# Altium project VIO_Camera_module.PrjPcb
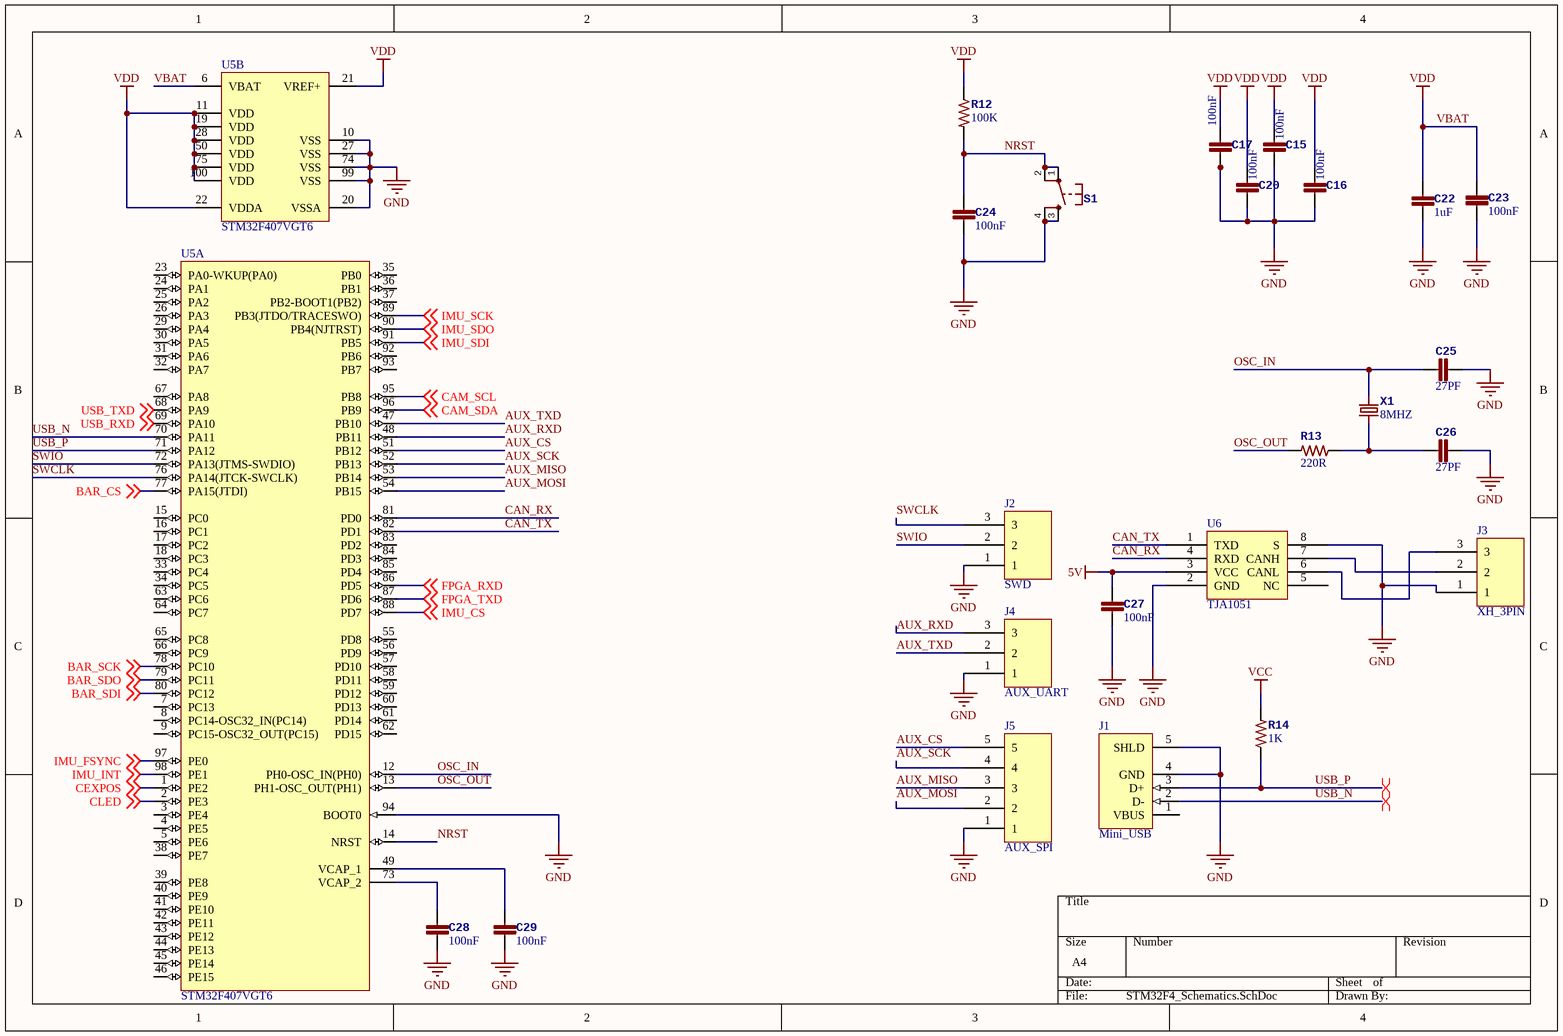
[diagram p0: STM32F4_Schematics.SchDoc]
4 sheets, 58 parts. Net scope: global (net labels, ports and power ports of the same name join across sheets).
Board file: PCB.PcbDoc
Sheets:
  STM32F4_Schematics.SchDoc
  Camera_Schematics.SchDoc
  IMU_Schematics.SchDoc
  USB3_Controller_Schematics.SchDoc

## Sheet STM32F4_Schematics.SchDoc
size A4

### Parts
C15  value 100nF  [_0805]  (hidden comment: Cap)
C16  value 100nF  [_0805]  (hidden comment: Cap)
C17  value 100nF  [_0805]  (hidden comment: Cap)
C20  value 100nF  [_0805]  (hidden comment: Cap)
C22  value 1uF  [_0805]  (hidden comment: Cap)
C23  value 100nF  [_0805]  (hidden comment: Cap)
C24  value 100nF  [_0805]  (hidden comment: Cap)
C25  value 27PF  [_0805]  (hidden comment: Cap)
C26  value 27PF  [_0805]  (hidden comment: Cap)
C27  value 100nF  [_0805]  (hidden comment: Cap)
C28  value 100nF  [_0805]  (hidden comment: Cap)
C29  value 100nF  [_0805]  (hidden comment: Cap)
J1  Mini_USB  [My_USB]
J2  SWD  [XH_3PIN]
J3  XH_3PIN  [XH_3PIN]
J4  AUX_UART  [XH_3PIN]
J5  AUX_SPI  [XH_5PIN]
R12  value 100K  [_0603]  (hidden comment: Resistor)
R13  value 220R  [_0603]  (hidden comment: Resistor)
R14  value 1K  [_0603]  (hidden comment: Resistor)
S1  PushButton-4Pin  [_TACTILE_SWITCH_PTH_6.0MM]  (value not drawn)
U5  STM32F407VGT6  [STM-LQFP100_N]  (parts A,B of 2)
U6  TJA1051  [SO-8N]
X1  value 8MHZ  [_CRYSTAL-HC49UP]  (hidden comment: Crystal_1)

### Nets
5V: C27.2 U6.3(VCC)
GND: C15.1 C16.1 C17.1 C20.1 C22.1 C23.1 C24.2 C25.2 C26.2 C27.1 C28.1 C29.1 J1.4(GND) J1.5(SHLD) J2.1 J3.1 J4.1 J5.1 S1.3 S1.4 U5.10(VSS) U5.20(VSSA) U5.27(VSS) U5.74(VSS) U5.94(BOOT0) U5.99(VSS) U6.2(GND) U6.8(S)
VBAT: C15.2 C16.2 C17.2 C20.2 C22.2 C23.2 R12.1 U5.6(VBAT) U5.11(VDD) U5.19(VDD) U5.21(VREF+) U5.22(VDDA) U5.28(VDD) U5.50(VDD) U5.75(VDD) U5.100(VDD)  [also labelled VDD]
VCC: R14.2
AUX_CS: J5.5 U5.51(PB12)
AUX_MISO: J5.3 U5.53(PB14)
AUX_MOSI: J5.2 U5.54(PB15)
AUX_RXD: J4.3 U5.48(PB11)
AUX_SCK: J5.4 U5.52(PB13)
AUX_TXD: J4.2 U5.47(PB10)
BAR_CS: U5.77(PA15(JTDI)) ; off-sheet BAR_CS
BAR_SCK: U5.78(PC10) ; off-sheet BAR_SCK
BAR_SDI: U5.80(PC12) ; off-sheet BAR_SDI
BAR_SDO: U5.79(PC11) ; off-sheet BAR_SDO
CAM_SCL: U5.95(PB8) ; off-sheet CAM_SCL
CAM_SDA: U5.96(PB9) ; off-sheet CAM_SDA
CAN_RX: U5.81(PD0) U6.4(RXD)
CAN_TX: U5.82(PD1) U6.1(TXD)
CEXPOS: U5.1(PE2) ; off-sheet CEXPOS
CLED: U5.2(PE3) ; off-sheet CLED
FPGA_RXD: U5.86(PD5) ; off-sheet FPGA_RXD
FPGA_TXD: U5.87(PD6) ; off-sheet FPGA_TXD
IMU_CS: U5.88(PD7) ; off-sheet IMU_CS
IMU_FSYNC: U5.97(PE0) ; off-sheet IMU_FSYNC
IMU_INT: U5.98(PE1) ; off-sheet IMU_INT
IMU_SCK: U5.89(PB3(JTDO/TRACESWO)) ; off-sheet IMU_SCK
IMU_SDI: U5.91(PB5) ; off-sheet IMU_SDI
IMU_SDO: U5.90(PB4(NJTRST)) ; off-sheet IMU_SDO
NRST: C24.1 R12.2 S1.1 S1.2 U5.14(NRST)
OSC_IN: C25.1 U5.12(PH0-OSC_IN(PH0)) X1.2
OSC_OUT: R13.2 U5.13(PH1-OSC_OUT(PH1))
SWCLK: J2.3 U5.76(PA14(JTCK-SWCLK))
SWIO: J2.2 U5.72(PA13(JTMS-SWDIO))
USB_N: J1.2(D-) U5.70(PA11)
USB_P: J1.3(D+) R14.1 U5.71(PA12)
USB_RXD: U5.69(PA10) ; off-sheet USB_RXD
USB_TXD: U5.68(PA9) ; off-sheet USB_TXD
NetC26_1: C26.1 R13.1 X1.1
NetC28_2: C28.2 U5.73(VCAP_2)
NetC29_2: C29.2 U5.49(VCAP_1)
NetJ3_2: J3.2 U6.7(CANH)
NetJ3_3: J3.3 U6.6(CANL)

Not connected (* = marked no-connect by the designer): J1 1(VBUS); U5 3(PE4) 4(PE5) 5(PE6) 7(PC13) 8(PC14-OSC32_IN(PC14)) 9(PC15-OSC32_OUT(PC15)) 15(PC0) 16(PC1) 17(PC2) 18(PC3) 23(PA0-WKUP(PA0)) 24(PA1) 25(PA2) 26(PA3) 29(PA4) 30(PA5) 31(PA6) 32(PA7) 33(PC4) 34(PC5) 35(PB0) 36(PB1) 37(PB2-BOOT1(PB2)) 38(PE7) 39(PE8) 40(PE9) 41(PE10) 42(PE11) 43(PE12) 44(PE13) 45(PE14) 46(PE15) 55(PD8) 56(PD9) 57(PD10) 58(PD11) 59(PD12) 60(PD13) 61(PD14) 62(PD15) 63(PC6) 64(PC7) 65(PC8) 66(PC9) 67(PA8) 83(PD2) 84(PD3) 85(PD4) 92(PB6) 93(PB7); U6 5(NC)

### Layout directives
differential pair: USB_N, USB_P

### Library data of the parts
C15-C17 C20 C22-C29 = Cap_1
J1 = Mini_USB: USB 2.0, Right Angle, SMT, B Type, Receptacle, 5 Position, Black; ContactMaterial: Copper Alloy; ContactPlating: Gold (30); PCB_Layout: Complies with manufacturer's recommendation.; DrillSize: Corresponds to nominal value.; PanelGround: Without; Published: 15-Jul-2004; DatasheetDocument: 27-Jun-2003; PackageDocument: 27-Jun-2003; PackageReference: 440247; Publisher: Altium Limited; HousingMaterial: Thermoplastic; ComponentLink1Description: Manufacturer Link; ComponentLink1URL: http://www.tycoelectronics.com/; ComponentLink2Description: Packaging Specification; ComponentLink2URL: http://ecommas.tycoelectronics.com/commerce/DocumentDelivery/DDEController?Action=showdoc&DocId=Customer+Drawing%7F440247%7FD%7Fpdf%7FEnglish%7FC_440247_D.pdf
J2 J4 = XH_3PIN
J5 = XH_5PIN
S1 = PushButton-4Pin: PROD_ID: SWCH-13065
U5 = STM32F407VGT6: ARM Cortex-M4 32-bit MCU+FPU, 210 DMIPS, 1024 kB Flash, 192 kB Internal RAM, 82 I/Os, 100-pin LQFP, -40 to 85 degC, Tray; Manufacturer: STMicroelectronics; D/A Converter: 2x12-bit; FLASH Size (Prog) (kB): 1024; I/Os (High Current): 82; Internal RAM Size (kB): 192; Operating Frequency(F) (Processor speed) (MHz): 168; Supply Voltage(Vcc) max (V): 3.6; Supply Voltage(Vcc) min (V): 1.8; DatasheetVersion: Rev. 4; PackageVersion: Rev. 1, 06/2013; PackageReference: LQFP100; PackageDescription: 100-Pin Low Profile Quad Flat Package, 14 x 14 mm Body, 0.5 mm Pitch; Supplier 1: Digi-Key; Supplier Part Number 1: 497-11605-ND; Supplier 2: Farnell; Supplier Part Number 2: 2064368; Supplier 3: Newark; Supplier Part Number 3: 73T2333; Supplier 4: Mouser; Supplier Part Number 4: 511-STM32F407VGT6; Core: ARM Cortex-M4; Packing: Tray; Mounting Technology: Surface Mount; PartNumber: STM32F407VGT6; ComponentLink1Description: Manufacturer URL; ComponentLink1URL: http://www.st.com/web/en/home.html; ComponentLink2Description: Datasheet; ComponentLink2URL: http://www.st.com/st-web-ui/static/active/en/resource/technical/document/datasheet/DM00037051.pdf; ComponentLink3Description: Package Specification; ComponentLink3URL: http://www.st.com/st-web-ui/static/active/en/resource/technical/document/data_brief/DM00071938.pdf

## Sheet Camera_Schematics.SchDoc
size A
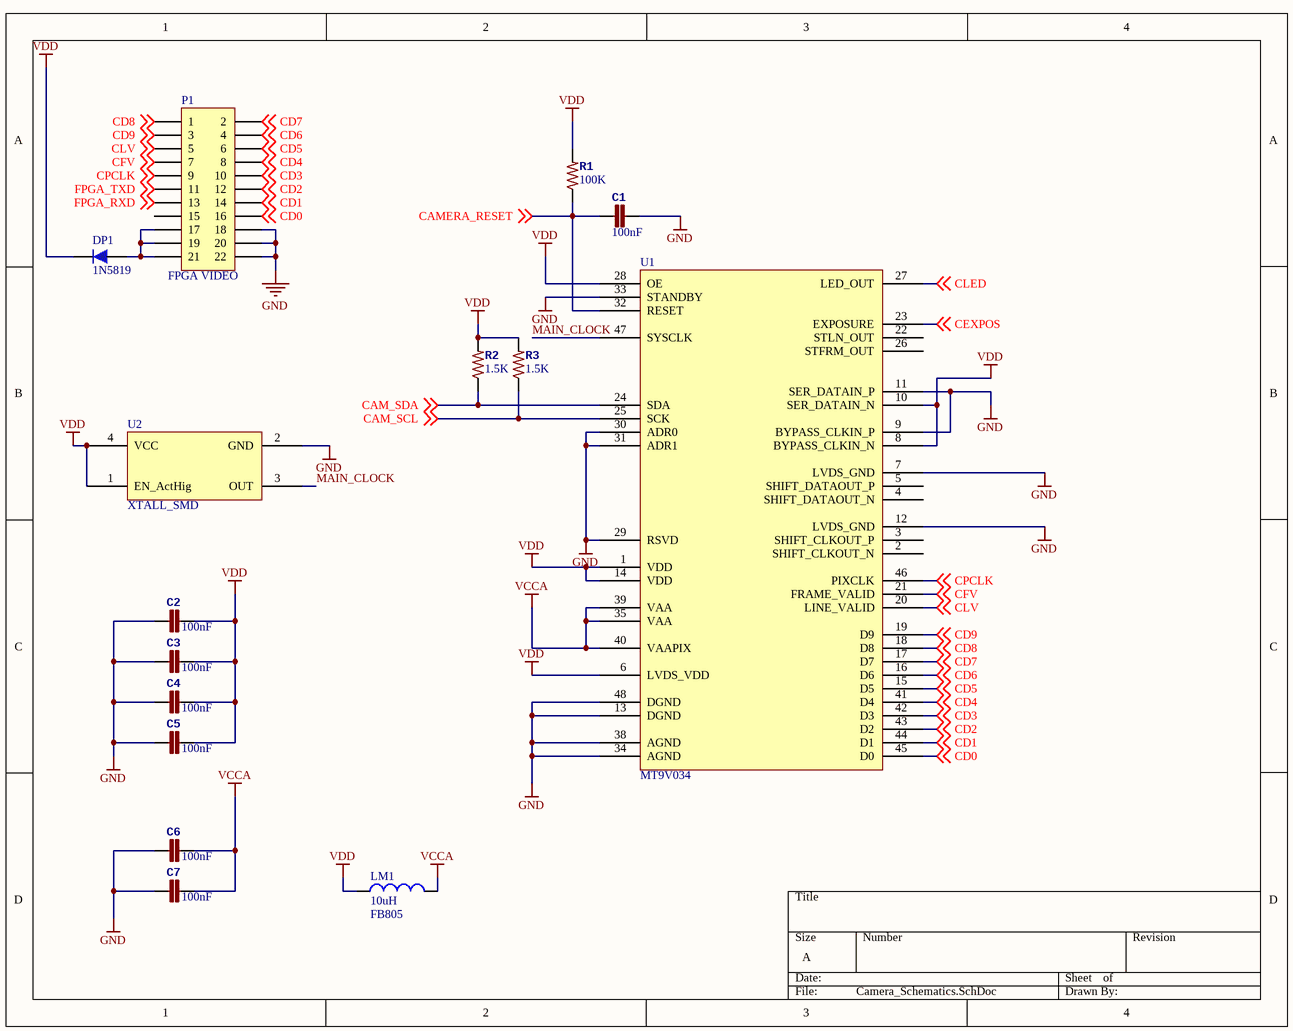
[diagram p1: Camera_Schematics.SchDoc]

### Parts
C1  value 100nF  [_0805]  (hidden comment: Cap)
C2  value 100nF  [_0805]  (hidden comment: Cap)
C3  value 100nF  [_0805]  (hidden comment: Cap)
C4  value 100nF  [_0805]  (hidden comment: Cap)
C5  value 100nF  [_0805]  (hidden comment: Cap)
C6  value 100nF  [_0805]  (hidden comment: Cap)
C7  value 100nF  [_0805]  (hidden comment: Cap)
DP1  1N5819  [430X270D]
LM1  10uH  value FB805  [0805L]
P1  FPGA VIDEO  [HDR2X11]
R1  value 100K  [_0603]  (hidden comment: Resistor)
R2  value 1.5K  [_0603]  (hidden comment: Resistor)
R3  value 1.5K  [_0603]  (hidden comment: Resistor)
U1  MT9V034  [MT9V034]
U2  XTALL_SMD  [XTAL_SMD]

### Nets
GND: C1.2 C2.1 C3.1 C4.1 C5.1 C6.1 C7.1 P1.18 P1.20 P1.22 U1.7(LVDS_GND) U1.9(BYPASS_CLKIN_P) U1.11(SER_DATAIN_P) U1.12(LVDS_GND) U1.13(DGND) U1.29(RSVD) U1.30(ADR0) U1.31(ADR1) U1.33(STANDBY) U1.34(AGND) U1.38(AGND) U1.48(DGND) U2.2(GND)
VCCA: C6.2 C7.2 LM1.2 U1.35(VAA) U1.39(VAA) U1.40(VAAPIX)
VDD: C2.2 C3.2 C4.2 C5.2 DP1.2 LM1.1 R1.2 R2.2 R3.2 U1.1(VDD) U1.6(LVDS_VDD) U1.8(BYPASS_CLKIN_N) U1.10(SER_DATAIN_N) U1.14(VDD) U1.28(OE) U2.1(EN_ActHig) U2.4(VCC)  [project net VBAT]
CAM_SCL: R3.1 U1.25(SCK) ; off-sheet CAM_SCL
CAM_SDA: R2.1 U1.24(SDA) ; off-sheet CAM_SDA
CAMERA_RESET: C1.1 R1.1 U1.32(RESET) ; off-sheet CAMERA_RESET
CD0: P1.16 U1.45(D0) ; off-sheet CD0
CD1: P1.14 U1.44(D1) ; off-sheet CD1
CD2: P1.12 U1.43(D2) ; off-sheet CD2
CD3: P1.10 U1.42(D3) ; off-sheet CD3
CD4: P1.8 U1.41(D4) ; off-sheet CD4
CD5: P1.6 U1.15(D5) ; off-sheet CD5
CD6: P1.4 U1.16(D6) ; off-sheet CD6
CD7: P1.2 U1.17(D7) ; off-sheet CD7
CD8: P1.1 U1.18(D8) ; off-sheet CD8
CD9: P1.3 U1.19(D9) ; off-sheet CD9
CEXPOS: U1.23(EXPOSURE) ; off-sheet CEXPOS
CFV: P1.7 U1.21(FRAME_VALID) ; off-sheet CFV
CLED: U1.27(LED_OUT) ; off-sheet CLED
CLV: P1.5 U1.20(LINE_VALID) ; off-sheet CLV
CPCLK: P1.9 U1.46(PIXCLK) ; off-sheet CPCLK
FPGA_RXD: P1.13 ; off-sheet FPGA_RXD
FPGA_TXD: P1.11 ; off-sheet FPGA_TXD
MAIN_CLOCK: U1.47(SYSCLK) U2.3(OUT)
NetDP1_1: DP1.1 P1.17 P1.19 P1.21

Not connected (* = marked no-connect by the designer): P1 15; U1 2(SHIFT_CLKOUT_N) 3(SHIFT_CLKOUT_P) 4(SHIFT_DATAOUT_N) 5(SHIFT_DATAOUT_P) 22(STLN_OUT) 26(STFRM_OUT)

### Library data of the parts
C1-C7 = Cap_1
DP1 = 1N5819: Schottkey Rectifiers; Designer: Abbas Basereh; Data: 16-12-2016; Link: *; Part. No: *
LM1 = L SMA 0.25W: Inductor; Code_IEC: 1005; Published: 8-Jun-2000; LatestRevisionDate: 29-May-2009; LatestRevisionNote: IPC-7351 Footprint Added.; PackageReference: 0402-A; Publisher: Altium Limited; PackageDescription: Chip Inductor; Code_JEITA: 0402
P1 = Header 11X2: Header, 11-Pin, Dual row; LatestRevisionDate: 17-Jul-2002; LatestRevisionNote: Re-released for DXP Platform.; Publisher: Altium Limited
U2 = XTAL_SMD

## Sheet IMU_Schematics.SchDoc: MPU9250 IMU Unit
size A4; DrawnBy: Hamed Damirchi; Organization: ARAS Robotics Group; Revision: 1.0; ProjectName: VIO_Camera_Module
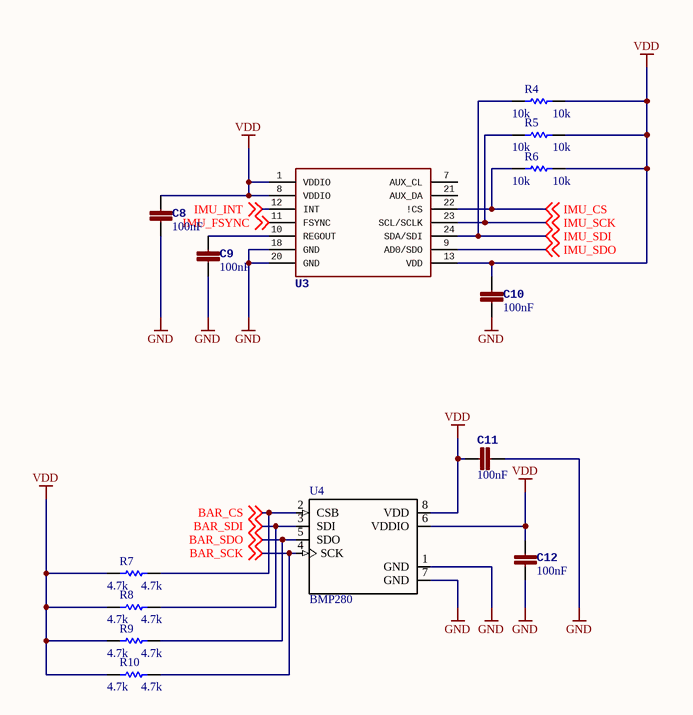
[diagram p2: IMU_Schematics.SchDoc]

### Parts
C8  value 100nF  [_0603]  (hidden comment: Cap)
C9  value 100nF  [_0603]  (hidden comment: Cap)
C10  value 100nF  [_0603]  (hidden comment: Cap)
C11  value 100nF  [_0603]  (hidden comment: Cap)
C12  value 100nF  [_0603]  (hidden comment: Cap)
R4  10k  [RES0603]
R5  10k  [RES0603]
R6  10k  [RES0603]
R7  4.7k  [RES0603]
R8  4.7k  [RES0603]
R9  4.7k  [RES0603]
R10  4.7k  [RES0603]
U3  MPU-9250  [_QFN-24-EP]  (value not drawn)
U4  BMP280  [*XDCR_BMP280]

### Nets
GND: C8.1 C9.1 C10.1 C11.2 C12.2 U3.18(GND) U3.20(GND) U4.1(GND) U4.7(GND)
VDD: C8.2 C10.2 C11.1 C12.1 R4.2 R5.2 R6.2 R7.1 R8.1 R9.1 R10.1 U3.1(VDDIO) U3.8(VDDIO) U3.13(VDD) U4.6(VDDIO) U4.8(VDD)  [project net VBAT]
BAR_CS: R7.2 U4.2(CSB) ; off-sheet BAR_CS
BAR_SCK: R10.2 U4.4(SCK) ; off-sheet BAR_SCK
BAR_SDI: R8.2 U4.3(SDI) ; off-sheet BAR_SDI
BAR_SDO: R9.2 U4.5(SDO) ; off-sheet BAR_SDO
IMU_CS: R6.1 U3.22(!CS) ; off-sheet IMU_CS
IMU_FSYNC: U3.11(FSYNC) ; off-sheet IMU_FSYNC
IMU_INT: U3.12(INT) ; off-sheet IMU_INT
IMU_SCK: R5.1 U3.23(SCL/SCLK) ; off-sheet IMU_SCK
IMU_SDI: R4.1 U3.24(SDA/SDI) ; off-sheet IMU_SDI
IMU_SDO: U3.9(AD0/SDO) ; off-sheet IMU_SDO
NetC9_2: C9.2 U3.10(REGOUT)

Not connected (* = marked no-connect by the designer): U3 7(AUX_CL) 21(AUX_DA)

### Library data of the parts
C8-C12 = Cap_1
R4-R10 = RES SMD PACKAGE: TOTAL SMD RESISTOR PACK; Designer: Abbas Basereh; Desc.: RES SMD PAKAGES; Data: 2017-3-10
  R4-R6: VALUE: 10k
  R7-R10: VALUE: 4.7k
U3 = MPU-9250: PROD_ID: IC-13192
U4 = BMP280: BMP280 Absolute Barometric Pressure Sensor for Battery Powered Devices 2 x 2.5mm; MF: Bosch; MP: BMP280; Price: None; Availability: Unavailable; SnapEDA_Link: https://www.snapeda.com/parts/BMP280/Bosch%20Sensortec/view-part/?ref=snap; Package: SMD-8 Bosch Tools; Value: *

## Sheet USB3_Controller_Schematics.SchDoc
size A
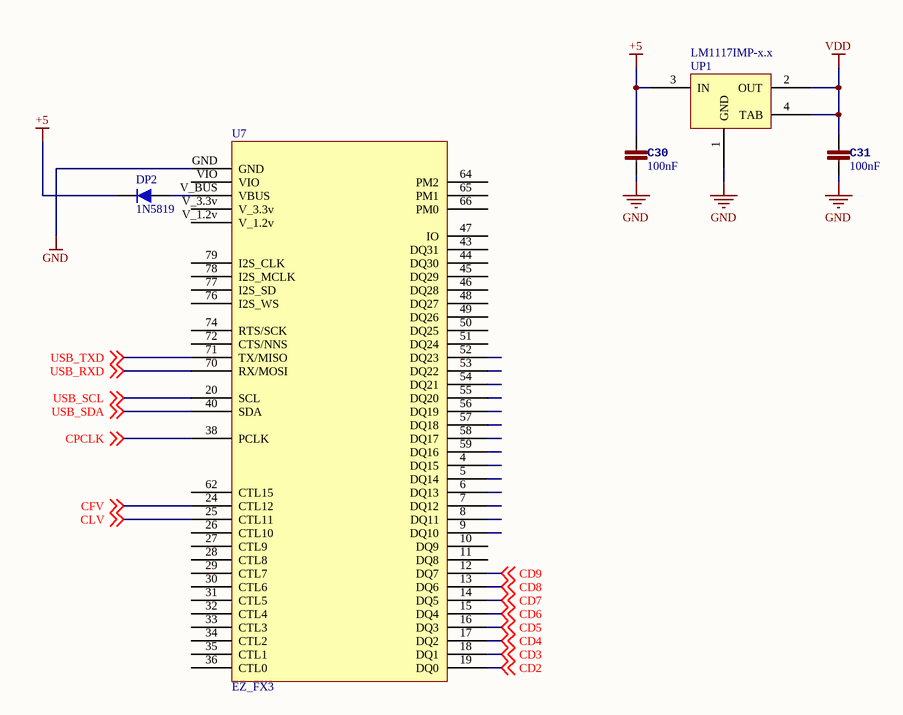
[diagram p3: USB3_Controller_Schematics.SchDoc]

### Parts
C30  value 100nF  [_0805]  (hidden comment: Cap)
C31  value 100nF  [_0805]  (hidden comment: Cap)
DP2  1N5819  [430X270D]
U7  EZ_FX3  [EZ_FX3]
UP1  LM1117IMP-x.x  [SOT223_4]

### Nets
+5: C30.1 DP2.2 UP1.3(IN)
GND: C30.2 C31.2 U7.GND UP1.1(GND)
VDD: C31.1 UP1.2(OUT) UP1.4(TAB)  [project net VBAT]
CD2: U7.19(DQ0) ; off-sheet CD2
CD3: U7.18(DQ1) ; off-sheet CD3
CD4: U7.17(DQ2) ; off-sheet CD4
CD5: U7.16(DQ3) ; off-sheet CD5
CD6: U7.15(DQ4) ; off-sheet CD6
CD7: U7.14(DQ5) ; off-sheet CD7
CD8: U7.13(DQ6) ; off-sheet CD8
CD9: U7.12(DQ7) ; off-sheet CD9
CFV: U7.24(CTL12) ; off-sheet CFV
CLV: U7.25(CTL11) ; off-sheet CLV
CPCLK: U7.38(PCLK) ; off-sheet CPCLK
USB_RXD: U7.70(RX/MOSI) ; off-sheet USB_RXD
USB_SCL: U7.20(SCL) ; off-sheet USB_SCL
USB_SDA: U7.40(SDA) ; off-sheet USB_SDA
USB_TXD: U7.71(TX/MISO) ; off-sheet USB_TXD
NetDP2_1: DP2.1 U7.V_BUS(VBUS)

Not connected (* = marked no-connect by the designer): U7 4(DQ15) 5(DQ14) 6(DQ13) 7(DQ12) 8(DQ11) 9(DQ10) 10(DQ9) 11(DQ8) 26(CTL10) 27(CTL9) 28(CTL8) 29(CTL7) 30(CTL6) 31(CTL5) 32(CTL4) 33(CTL3) 34(CTL2) 35(CTL1) 36(CTL0) 43(DQ31) 44(DQ30) 45(DQ29) 46(DQ28) 47(IO) 48(DQ27) 49(DQ26) 50(DQ25) 51(DQ24) 52(DQ23) 53(DQ22) 54(DQ21) 55(DQ20) 56(DQ19) 57(DQ18) 58(DQ17) 59(DQ16) 62(CTL15) 64(PM2) 65(PM1) 66(PM0) 72(CTS/NNS) 74(RTS/SCK) 76(I2S_WS) 77(I2S_SD) 78(I2S_MCLK) 79(I2S_CLK) V_1.2v V_3.3v VIO

### Library data of the parts
C30 C31 = Cap_1
DP2 = 1N5819: as DP1 on sheet Camera_Schematics; Data: 16-12-2016; Link: *; Part. No: *
UP1 = LM1117IMP-x.x: x.x Volt, 800mA Low-Dropout Linear Regulator, 4-pin SOT-223; Designer: Abbas Basereh; Data: 16-12-2016; VALUE: LM1117IMP-x.x

## Nets that join several sheets
GND: STM32F4_Schematics (28 pins), Camera_Schematics (23 pins), IMU_Schematics (9 pins), USB3_Controller_Schematics (C30.2 C31.2 U7.GND UP1.1)
VBAT: STM32F4_Schematics (16 pins), Camera_Schematics (17 pins), IMU_Schematics (16 pins), USB3_Controller_Schematics (C31.1 UP1.2 UP1.4)
BAR_CS: STM32F4_Schematics (U5.77), IMU_Schematics (R7.2 U4.2)
BAR_SCK: STM32F4_Schematics (U5.78), IMU_Schematics (R10.2 U4.4)
BAR_SDI: STM32F4_Schematics (U5.80), IMU_Schematics (R8.2 U4.3)
BAR_SDO: STM32F4_Schematics (U5.79), IMU_Schematics (R9.2 U4.5)
CAM_SCL: STM32F4_Schematics (U5.95), Camera_Schematics (R3.1 U1.25)
CAM_SDA: STM32F4_Schematics (U5.96), Camera_Schematics (R2.1 U1.24)
CD2: Camera_Schematics (P1.12 U1.43), USB3_Controller_Schematics (U7.19)
CD3: Camera_Schematics (P1.10 U1.42), USB3_Controller_Schematics (U7.18)
CD4: Camera_Schematics (P1.8 U1.41), USB3_Controller_Schematics (U7.17)
CD5: Camera_Schematics (P1.6 U1.15), USB3_Controller_Schematics (U7.16)
CD6: Camera_Schematics (P1.4 U1.16), USB3_Controller_Schematics (U7.15)
CD7: Camera_Schematics (P1.2 U1.17), USB3_Controller_Schematics (U7.14)
CD8: Camera_Schematics (P1.1 U1.18), USB3_Controller_Schematics (U7.13)
CD9: Camera_Schematics (P1.3 U1.19), USB3_Controller_Schematics (U7.12)
CEXPOS: STM32F4_Schematics (U5.1), Camera_Schematics (U1.23)
CFV: Camera_Schematics (P1.7 U1.21), USB3_Controller_Schematics (U7.24)
CLED: STM32F4_Schematics (U5.2), Camera_Schematics (U1.27)
CLV: Camera_Schematics (P1.5 U1.20), USB3_Controller_Schematics (U7.25)
CPCLK: Camera_Schematics (P1.9 U1.46), USB3_Controller_Schematics (U7.38)
FPGA_RXD: STM32F4_Schematics (U5.86), Camera_Schematics (P1.13)
FPGA_TXD: STM32F4_Schematics (U5.87), Camera_Schematics (P1.11)
IMU_CS: STM32F4_Schematics (U5.88), IMU_Schematics (R6.1 U3.22)
IMU_FSYNC: STM32F4_Schematics (U5.97), IMU_Schematics (U3.11)
IMU_INT: STM32F4_Schematics (U5.98), IMU_Schematics (U3.12)
IMU_SCK: STM32F4_Schematics (U5.89), IMU_Schematics (R5.1 U3.23)
IMU_SDI: STM32F4_Schematics (U5.91), IMU_Schematics (R4.1 U3.24)
IMU_SDO: STM32F4_Schematics (U5.90), IMU_Schematics (U3.9)
USB_RXD: STM32F4_Schematics (U5.69), USB3_Controller_Schematics (U7.70)
USB_TXD: STM32F4_Schematics (U5.68), USB3_Controller_Schematics (U7.71)